# EasyEDA Pro project EasyEDApro.epro, schematic Main board
Create Date: 2024-05-27; Page Name: P1; Project Name: Robonomics SWS 2 GANG; Schematic Name: Main board; Update Date: 2024-05-27; Company: Robonomics.network; Drawed: ludovich88; Page Size: A3; Part Number: SWS-2G-E-ESP_MB; Reviewed: ludovich88; Version: V0.1
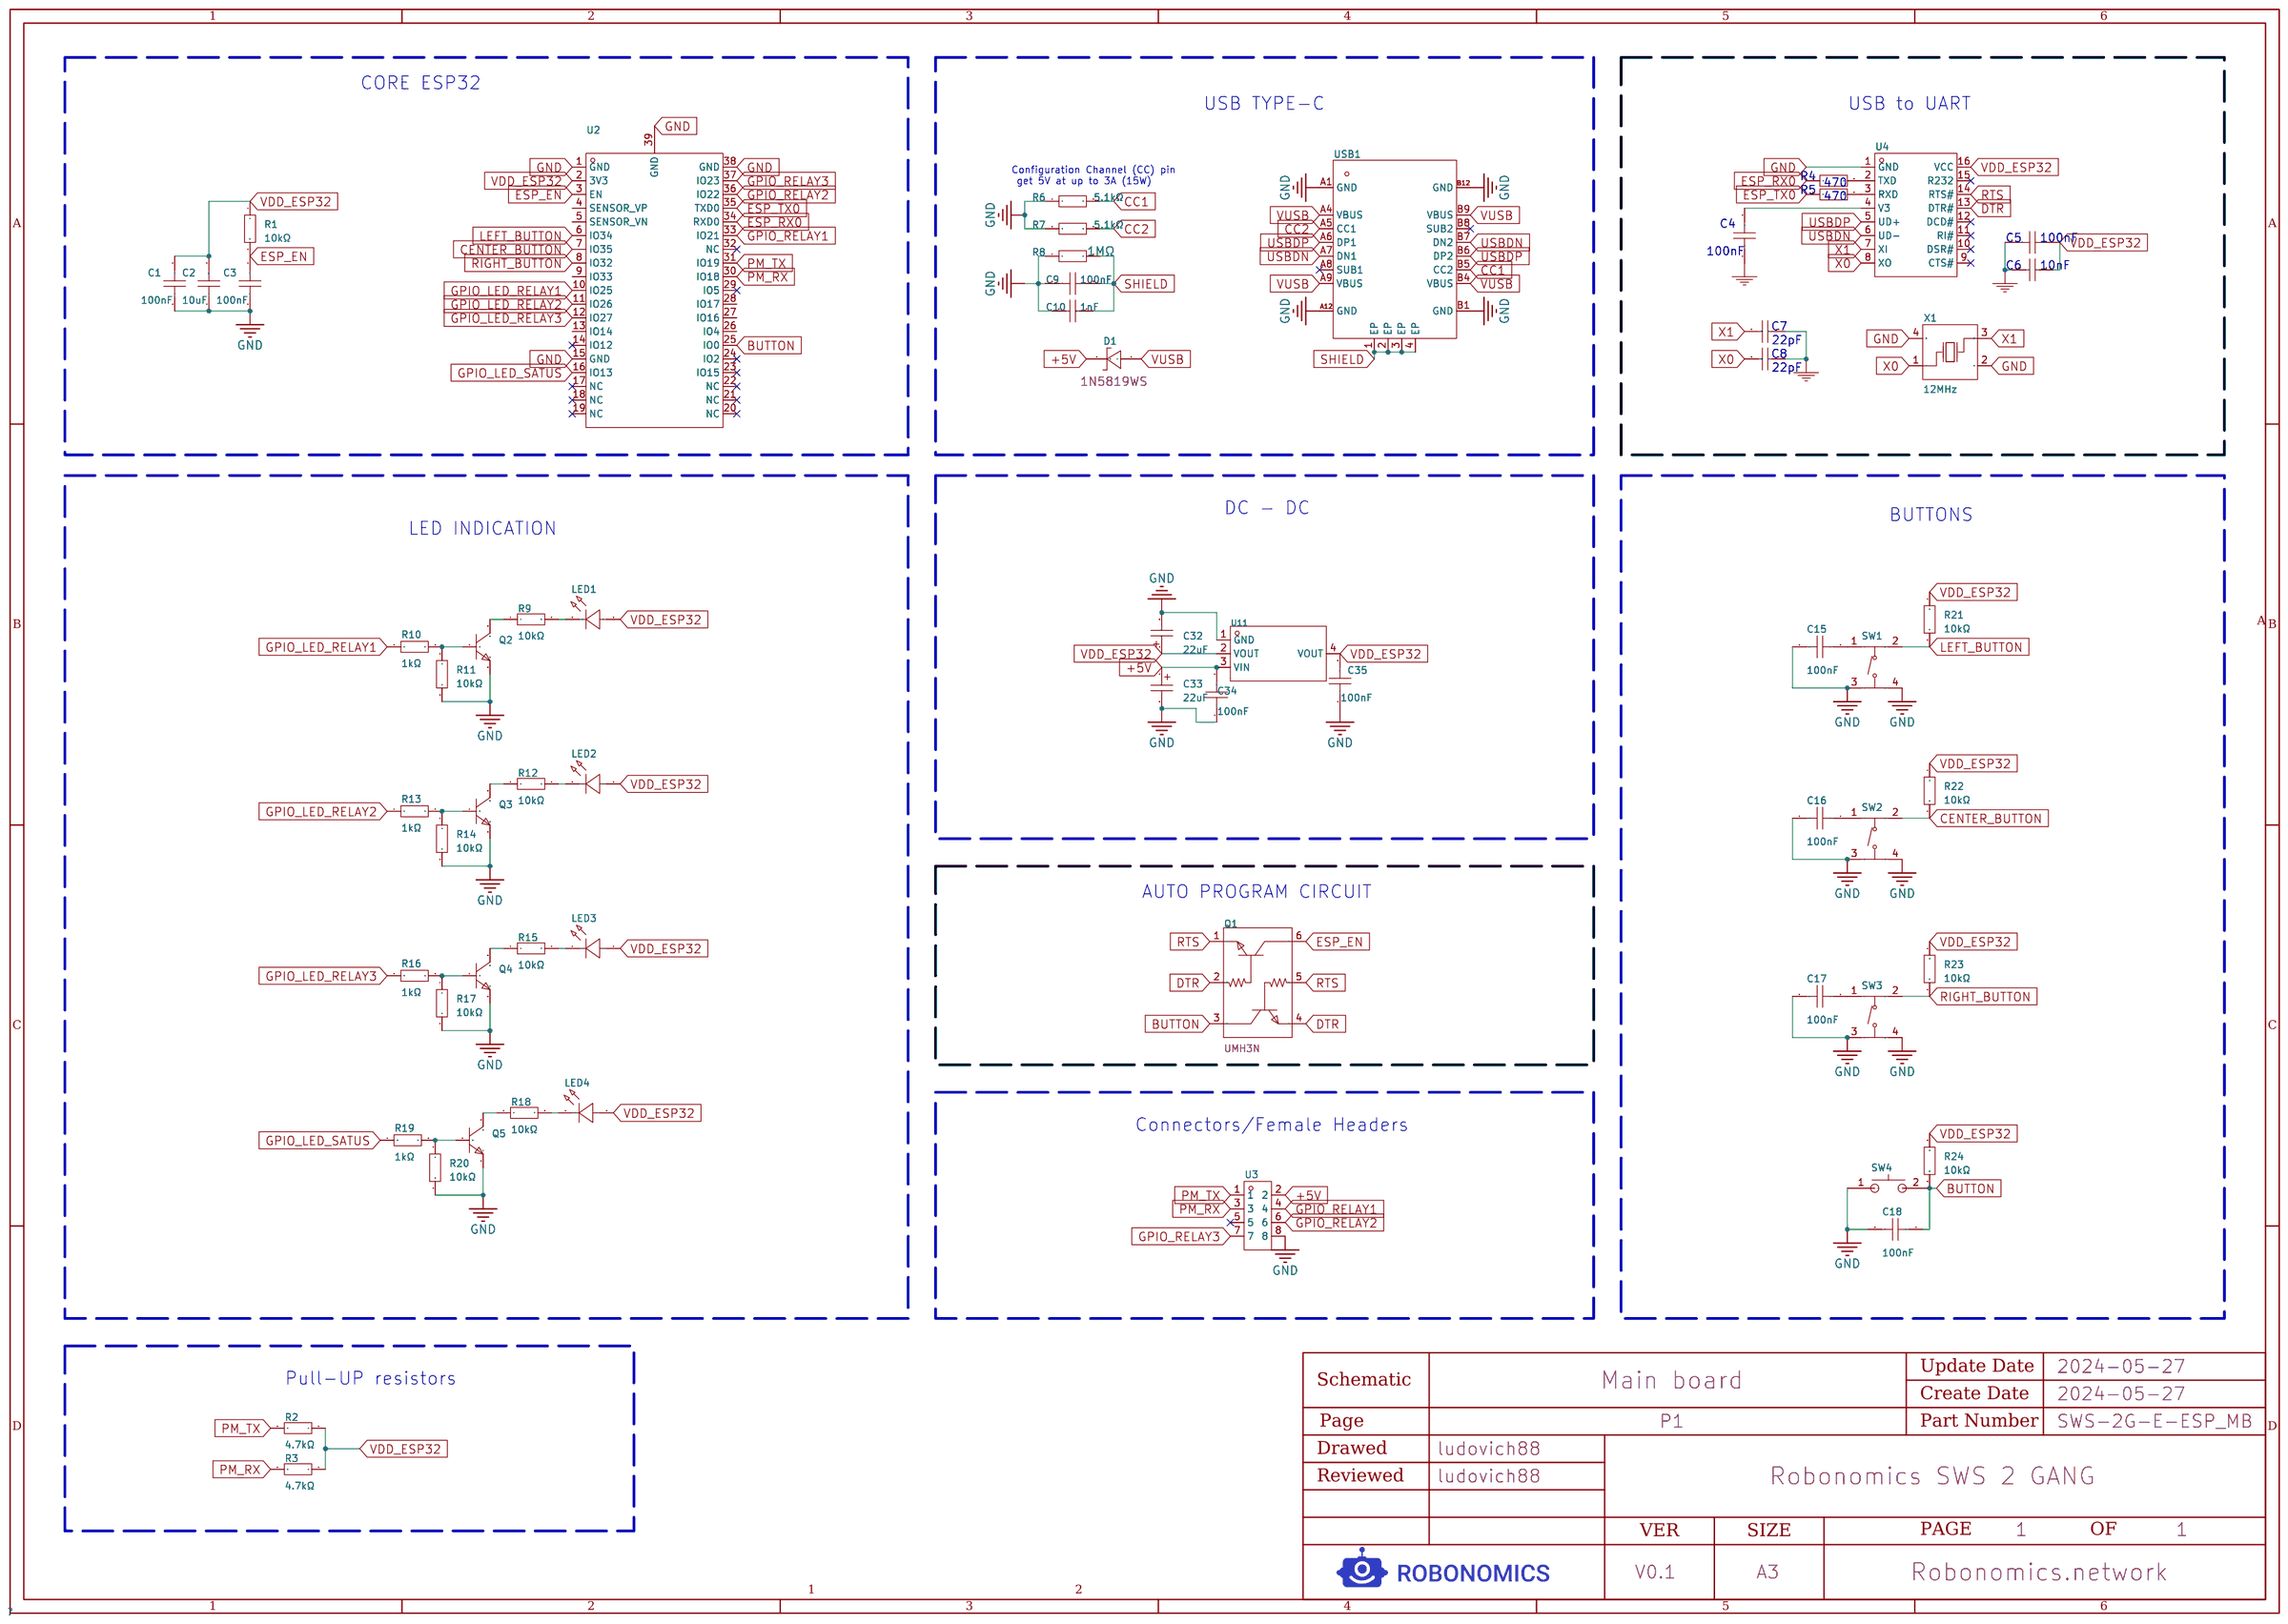
[diagram p1: schematic sheet]

## Parts
C1  100nF  [C0603]
C2  10uF  [C0603]
C3  100nF  [C0603]
C4  100nF  [C0603]
C5  100nF  [C0603]
C6  10nF  [C0603]
C7  22pF  [C0603]
C8  22pF  [C0603]
C9  100nF  [C0603]
C10  1nF  [C0603]
C15  100nF  [C0603]
C16  100nF  [C0603]
C17  100nF  [C0603]
C18  100nF  [C0603]
C32  22uF  [CASE-A_3216]
C33  22uF  [CASE-A_3216]
C34  100nF  [C0603]
C35  100nF  [C0603]
D1  -  [SOD-323_L1.8-W1.3-LS2.5-RD]
LED1  -  [LED0402-RD_BLUE]
LED2  -  [LED0402-RD_BLUE]
LED3  -  [LED0402-RD_BLUE]
LED4  -  [LED0402-RD_GREEN]
Q1  -  [SC-70-6_L2.2-W1.3-P0.65-LS2.1-BR]
Q2  -  [SOT-23-3_L2.9-W1.6-P1.90-LS2.8-BR]
Q3  -  [SOT-23-3_L2.9-W1.6-P1.90-LS2.8-BR]
Q4  -  [SOT-23-3_L2.9-W1.6-P1.90-LS2.8-BR]
Q5  -  [SOT-23-3_L2.9-W1.6-P1.90-LS2.8-BR]
R1  10kΩ  [R0603]
R2  4.7kΩ  [R0603]
R3  4.7kΩ  [R0603]
R4  470  [R0603]
R5  470  [R0603]
R6  5.1kΩ  [R0603]
R7  5.1kΩ  [R0603]
R8  1MΩ  [R0603]
R9  10kΩ  [R0603]
R10  1kΩ  [R0603]
R11  10kΩ  [R0603]
R12  10kΩ  [R0603]
R13  1kΩ  [R0603]
R14  10kΩ  [R0603]
R15  10kΩ  [R0603]
R16  1kΩ  [R0603]
R17  10kΩ  [R0603]
R18  10kΩ  [R0603]
R19  1kΩ  [R0603]
R20  10kΩ  [R0603]
R21  10kΩ  [R0603]
R22  10kΩ  [R0603]
R23  10kΩ  [R0603]
R24  10kΩ  [R0603]
SW1  TS-1187A-C-J-B  [SW-SMD_4P-L5.1-W5.1-P3.70-LS6.5-TL-2]
SW2  TS-1187A-C-J-B  [SW-SMD_4P-L5.1-W5.1-P3.70-LS6.5-TL-2]  (no BOM)
SW3  TS-1187A-C-J-B  [SW-SMD_4P-L5.1-W5.1-P3.70-LS6.5-TL-2]
SW4  -  [SW-SMD_L3.9-W2.9-P4.15-LS5.0]
U2  -  [WIFI-SMD_ESP32-WROOM-32E]
U3  -  [CONN-TH_8P-P2.00_DEALON_DW200R-22-08-45]
U4  -  [SOIC-16_L9.9-W3.9-P1.27-LS6.0-BL]
U11  AMS1117-3.3  [SOT-223-3_L6.5-W3.4-P2.30-LS7.0-BR]
USB1  -  [USB-C-SMD_KH-TYPE-C-16P]
X1  12MHz  [OSC-SMD_4P-L3.2-W2.5-BL]

## Library data of the parts
C1 C3 = CC0603KRX7R9BB104: Capacitance: Tolerance:±10% Tolerance:±10% Voltage Rated: Temperature Coefficient:; LCSC Part Name: 100nF ±10% 50V; Supplier Part: C14663; Manufacturer: YAGEO(国巨); Supplier Footprint: 0603; JLCPCB Part Class: Basic Part; Datasheet: https://atta.szlcsc.com/upload/public/pdf/source/20180910/C282072_33301C7F631E79921B82A8DAC6BCC5B3.pdf; Supplier: LCSC; Tolerance: ±10%; Voltage Rated: 50V; Temperature Coefficient: Y5V
C2 = CL10A106KP8NNNC: Capacitance: Tolerance:±10% Tolerance:±10% Voltage Rated: Temperature Coefficient:; LCSC Part Name: 10uF ±10% 10V; Supplier Part: C19702; Manufacturer: SAMSUNG(三星); Supplier Footprint: 0603; JLCPCB Part Class: Basic Part; Datasheet: https://atta.szlcsc.com/upload/public/pdf/source/20160218/1457707763339.pdf; Supplier: LCSC; Tolerance: ±10%; Voltage Rated: 10V; Temperature Coefficient: X5R
C4 C5 C15-C18 C34 C35 = CC0603KRX7R9BB104: Capacitance: Tolerance:±10% Tolerance:±10% Voltage Rated: Temperature Coefficient:; LCSC Part Name: 100nF ±10% 50V; Supplier Part: C14663; Manufacturer: YAGEO(国巨); Supplier Footprint: 0603; JLCPCB Part Class: Basic Part; Datasheet: https://atta.szlcsc.com/upload/public/pdf/source/20180910/C282072_33301C7F631E79921B82A8DAC6BCC5B3.pdf; Supplier: LCSC; Tolerance: ±10%
C6 = 0603B103K500NT: Supplier: LCSC; Manufacturer: FH; Supplier Part: C57112; JLCPCB Part Class: BasicPart
C7 C8 = CL10C220JB8NNNC: Supplier: LCSC; Manufacturer: SAMSUNG; Supplier Part: C1653; JLCPCB Part Class: BasicPart
C9 = CC0603KRX7R9BB104: Capacitance: Tolerance:±10% Tolerance:±10% Voltage Rated: Temperature Coefficient:; LCSC Part Name: 100nF ±10% 50V; Supplier Part: C14663; Manufacturer: YAGEO(国巨); Supplier Footprint: 0603; JLCPCB Part Class: Basic Part; Datasheet: https://atta.szlcsc.com/upload/public/pdf/source/20180910/C282072_33301C7F631E79921B82A8DAC6BCC5B3.pdf; Supplier: LCSC; Tolerance: ±10%; Voltage Rated: 50V; Temperature Coefficient: X7R
C10 = CL10B102KB8NNNC: Capacitance:1nFTolerance:±10%Tolerance:±10%VoltageRated:50VTemperatureCoefficient:X7R; LCSC Part Name: 1nF±10%50V; Supplier Part: C1588; Manufacturer: SAMSUNG(三星); Supplier Footprint: 0603; JLCPCB Part Class: BasicPart; Datasheet: https://atta.szlcsc.com/upload/public/pdf/source/20160103/1457707679526.pdf; Supplier: LCSC; Tolerance: ±10%; Voltage Rated: 50V; Temperature Coefficient: X7R
C32 C33 = TAJA226K010RNJ: Capacitance: Tolerance:±10% Tolerance:±10% Rated Voltage: Equivalent Series Resistance(ESR):3Ω@100kHz Operating Temperature:-55℃~+125℃ Operating Temperature:-55℃~+125℃; LCSC Part Name: 22uF ±10% 10V; Supplier Part: C11366; Manufacturer: Kyocera AVX; JLCPCB Part Class: Extended Part; Datasheet: https://atta.szlcsc.com/upload/public/pdf/source/20160107/1457707744993.pdf; Supplier: LCSC; Tolerance: ±10%; Equivalent Series Resistance(ESR): 3Ω@100kHz; Operating Temperature: -55℃~+125℃
D1 = 1N5819WS: ReverseVoltage(Vr):40VAverageRectifiedCurrent(Io):1AForwardVoltage(Vf@If):600mV@1A; LCSC Part Name: 40V1A600mV@1A; Supplier Part: C191023; Manufacturer: Hottech(合科泰); Supplier Footprint: SOD-323; JLCPCB Part Class: BasicPart; Datasheet: https://atta.szlcsc.com/upload/public/pdf/source/20180614/C191023_3C6A6398B911F3A4C23E7538EE054643.pdf; Supplier: LCSC; Reverse Voltage (Vr): 40V; Average Rectified Current (Io): 1A; Forward Voltage (Vf@If): 600mV@1A
LED1-LED3 = SZYY0402B: EmittedColor:blueDominantWavelength:466nm~469nmDominantWavelength:466nm~469nmPeakWavelength:-ColorTemperature:-ColorTemperature:-LuminousFlux(@25℃):-ForwardCurrent:5mAForwardVoltage(VF):3.2VLuminousIntensity:85mcdPowerDissipation:-; LCSC Part Name: 蓝灯; Supplier Part: C434447; Manufacturer: yongyu(永裕光电); Supplier Footprint: 0402; Datasheet: https://atta.szlcsc.com/upload/public/pdf/source/20210222/C434447_30232BB6183B52026028ECA50B9DAB35.pdf; Supplier: LCSC; Emitted Color: blue; Dominant Wavelength: 466nm~469nm; Forward Current: 5mA; Forward Voltage (VF): 3.2V; Luminous Intensity: 85mcd; Viewing Angle: 120°; Operating Temperature: -40℃~+85℃
LED4 = SZYY0402G: EmittedColor:Emerald; LCSC Part Name: 翠绿; Supplier Part: C434446; Manufacturer: yongyu(永裕光电); Supplier Footprint: 0402; JLCPCB Part Class: ExtendedPart; Datasheet: https://atta.szlcsc.com/upload/public/pdf/source/20210222/C434446_DCC8DCB40C4FD7B302B323BBEA2FF3EC.pdf; Supplier: LCSC; Emitted Color: Emerald
Q1 = UMH3N: TransistorType:2个NPN-预偏置PowerDissipation(Pd):150mWCollectorCurrent(Ic):100mACollector-EmitterBreakdownVoltage(Vceo):50V; LCSC Part Name: 2个NPN-预偏置100mA50V; Supplier Part: C62892; Manufacturer: CJ(江苏长电/长晶); Supplier Footprint: SC-70-6(SOT-363); JLCPCB Part Class: ExtendedPart; Datasheet: https://atta.szlcsc.com/upload/public/pdf/source/20151109/1457707575095.pdf; Supplier: LCSC; Transistor Type: 2个NPN-预偏置; Power Dissipation (Pd): 150mW; Collector Current (Ic): 100mA; Collector-Emitter Breakdown Voltage (Vceo): 50V
Q2-Q5 = SS8050_C181160: TransistorType:Collector-EmitterBreakdownVoltage(Vceo):CollectorCurrent(Ic):PowerDissipation(Pd):CollectorCut-OffCurrent(Icbo):100nACollector-EmitterSaturationVoltage(VCE(sat)@Ic,Ib):500mV@800mA,80mADCCurrentGain(hFE@Ic,Vce):200@100; LCSC Part Name: NPN25V1.5AH档（200-350）; Supplier Part: C181160; Manufacturer: Hottech(合科泰); Manufacturer Part: SS8050; Supplier Footprint: SOT-23; JLCPCB Part Class: ExtendedPart; Datasheet: https://atta.szlcsc.com/upload/public/pdf/source/20220506/87BBA77FEE9CB4B19031AE933C67329E.pdf; Supplier: LCSC; Collector Cut-Off Current (Icbo): 100nA; Collector-Emitter Saturation Voltage (VCE(sat)@Ic,Ib): 500mV@800mA,80mA; DC Current Gain (hFE@Ic,Vce): 200@100mA,1V; Transition Frequency (fT): 100MHz; Operating Temperature: +150℃@(Tj)
R1 R9 R11 R12 R14 R15 R17 R18 R20-R24 = 0603WAF1002T5E: Resistance:10000Ω Tolerance:±1% Tolerance:±1% Power(Watts): Overload Voltage (Max): Temperature Coefficient:±100ppm/℃ Temperature Coefficient:±100ppm/℃ Type:Thick Film Resistors Operating Temperature Range:-55℃~+155℃ Operating Temperature Range:-55℃~+155℃; LCSC Part Name: 10kΩ ±1% 100mW 厚膜电阻; Supplier Part: C25804; Manufacturer: UNI-ROYAL(厚声); Supplier Footprint: 0603; JLCPCB Part Class: Basic Part; Datasheet: https://atta.szlcsc.com/upload/public/pdf/source/20200306/C422600_1E6D84923E4A46A82E41ADD87F860B5C.pdf; Supplier: LCSC; Tolerance: ±1%; Power(Watts): 1/10W; Overload Voltage (Max): 75V; Temperature Coefficient: ±100ppm/℃; Type: Thick Film Resistors; Operating Temperature Range: -55℃~+155℃
R2 R3 = RMC06034K7JN: Resistance:Tolerance:±5%Tolerance:±5%Power(Watts):; LCSC Part Name: 4.7kΩ±5%100mW; Supplier Part: C269694; Manufacturer: Tyohm(幸亚电阻); Supplier Footprint: 0603; JLCPCB Part Class: ExtendedPart; Datasheet: https://atta.szlcsc.com/upload/public/pdf/source/20190115/C269694_8DB59FA47BFB5717A32940FE118C845B.pdf; Supplier: LCSC; Tolerance: ±5%
R4 R5 = 0603WAF4700T5E: Supplier: LCSC; Manufacturer: UniOhm; Supplier Part: C23179; JLCPCB Part Class: BasicPart
R6 R7 = 0603WAF5101T5E: Type:厚膜电阻 Resistance:5.1kΩ Tolerance:±1% Power(Watts):1/10W Temperature Coefficient:±100ppm/ Temperature Coefficient:±100ppm/ Overload Voltage (Max):75V Operating Temperature Range:-55~+155 Operating Temperature Range:-55~+155; LCSC Part Name: 5.1kΩ±1%; Supplier Part: C23186; Manufacturer: UNI-ROYAL(厚声); Supplier Footprint: 0603; JLCPCB Part Class: BasicPart; Datasheet: https://atta.szlcsc.com/upload/public/pdf/source/20200306/C422600_1E6D84923E4A46A82E41ADD87F860B5C.pdf; Supplier: LCSC; Type: 厚膜电阻; Tolerance: ±1%; Power(Watts): 1/10W; Temperature Coefficient: ±100ppm/; Overload Voltage (Max): 75V; Operating Temperature Range: -55~+155
R8 = 0603WAF1004T5E: LCSC Part Name: 1MΩ(1004)±1%编带; Supplier Part: C22935; Manufacturer: UNI-ROYAL(厚声); Supplier Footprint: 0603; JLCPCB Part Class: BasicPart; Datasheet: https://atta.szlcsc.com/upload/public/pdf/source/20170920/C22935_1505900992858982324.pdf; Supplier: LCSC
R10 R13 R16 R19 = RC0603FR-071KL: Resistance:Tolerance:±1%Tolerance:±1%Power(Watts):TemperatureCoefficient:±100ppm/℃TemperatureCoefficient:±100ppm/℃OverloadVoltage(Max):OperatingTemperatureRange:-55℃~+155℃OperatingTemperatureRange:-55℃~+155℃; LCSC Part Name: 1kΩ±1%100mW; Supplier Part: C22548; Manufacturer: YAGEO(国巨); Supplier Footprint: 0603; JLCPCB Part Class: ExtendedPart; Datasheet: https://atta.szlcsc.com/upload/public/pdf/source/20180312/7BD3618A8B6324EA6280B0497A051AB7.pdf; Supplier: LCSC; Tolerance: ±1%; Temperature Coefficient: ±100ppm/℃; Operating Temperature Range: -55℃~+155℃
SW1-SW3 = TS-1187A-C-J-B: Contact Current:50mA Voltage Rating (DC):12V Insulation Resistance:- Circuit:SPST Mounting Style:Brick nogging Actuator Style:Round Button Actuator/Cap Color:金色 With Lamp:No Operating Force:260gf Mechanical Life:100000次 Operating Temperature:-30℃~+85℃ Ope; LCSC Part Name: 5.1*5.1*5mm 立贴 轻触开关; Supplier Part: C318885; Manufacturer: XKB Connectivity(中国星坤); Supplier Footprint: SMD; JLCPCB Part Class: Extended Part; Datasheet: https://atta.szlcsc.com/upload/public/pdf/source/20200227/C318885_9DC3A547B5B2026C7949C4FE22CAF34B.pdf; Supplier: LCSC; Contact Current: 50mA; Voltage Rating (DC): 12V; Circuit: SPST; Mounting Style: Brick nogging; Actuator Style: Round Button; Actuator/Cap Color: 金色; With Lamp: No; Operating Force: 260gf; Mechanical Life: 100000次; Operating Temperature: -30℃~+85℃; Switch Length: 5.1mm; Switch Width: 5.1mm; Switch Height: 5mm; Strike Gundam: NO
SW4 = GT-TC029B-H020-L1N: ContactCurrent:50mAVoltageRating(DC):12VInsulationResistance:100MΩCircuit:SPSTMountingStyle:BricknoggingActuatorStyle:RoundButtonActuator/CapColor:BlackWithLamp:NoOperatingForce:250gf@±30gfMechanicalLife:100000OperatingTemperature:-; LCSC Part Name: 立式两脚小龟H2.0250gf无柱; Supplier Part: C843665; Manufacturer: G-Switch(品赞); Supplier Footprint: SMD; Datasheet: https://atta.szlcsc.com/upload/public/pdf/source/20201014/C843665_B07D254A2E90B746498E934B945CCD5F.pdf; Supplier: LCSC; Contact Current: 50mA; Voltage Rating (DC): 12V; Insulation Resistance: 100MΩ; Circuit: SPST; Mounting Style: Bricknogging; Actuator Style: RoundButton; Actuator/Cap Color: Black; With Lamp: No; Operating Force: 250gf@±30gf; Mechanical Life: 100000; Operating Temperature: -30℃~+85℃; Pin Style: SMDSplicing; Switch Length: 3.9mm; Switch Width: 2.9mm; Switch Height: 2mm; Strike Gundam: NO
U2 = ESP32-WROOM-32E-N4_C701341: LCSC Part Name: 通用型Wi-Fi+BT+BLE的MCU模组PCB板载天线模组; Supplier Part: C701341; Manufacturer: ESPRESSIF(乐鑫); Manufacturer Part: ESP32-WROOM-32E-N4; Supplier Footprint: SMD,18x25.5mm; JLCPCB Part Class: ExtendedPart; Datasheet: https://atta.szlcsc.com/upload/public/pdf/source/20220601/0020821B65DE5740BBACA5FACC5CF3B6.pdf; Supplier: LCSC
U3 = DW200R-22-08-45: NumberofRows:双排NumberofHoles:8Pitch:2mmHolesStructure:2x4PRowSpacing:2mmMountingType:StraightCircularHole/SquareHole:SquareHolesCurrentRating(Max):1.5AVoltageRating(Max):-HolesDirection:TopInsulationHeight:4mmOperatingTempera; LCSC Part Name: 2mm2x4P; Supplier Part: C2935889; Manufacturer: DEALON(德艺隆); Supplier Footprint: 直插,P=2mm; Datasheet: https://atta.szlcsc.com/upload/public/pdf/source/20211231/4AAE734E989B72774920282673BDAE8F.pdf; Supplier: LCSC; Number of Rows: 双排; Number of Holes: 8; Pitch: 2mm; Holes Structure: 2x4P; Row Spacing: 2mm; Mounting Type: Straight; Circular Hole / Square Hole: SquareHoles; Current Rating (Max): 1.5A; Holes Direction: Top; Insulation Height: 4mm
U4 = CH340G: Type:TransceiverProtocol:USB2.0NumberofDrivers/Receivers:-DataRate:2MbpsSupplyVoltage:3.3V,5V; Supplier Part: C14267; Manufacturer: WCH(南京沁恒); Supplier Footprint: SOP-16_150mil; JLCPCB Part Class: ExtendedPart; Datasheet: https://atta.szlcsc.com/upload/public/pdf/source/20200819/C14267_9F0B4B8160AEBA86F3219E64956E4601.pdf; Supplier: LCSC; Type: Transceiver; Protocol: USB2.0; Data Rate: 2Mbps; Supply Voltage: 3.3V,5V
U11 = AMS1117-3.3_C6186: Output Type: Maximum Input Voltage:- Output Voltage:3.3V Output Voltage:3.3V MAX Output Current:1A Power Supply Rejection Ratio (PSRR):72dB@(120Hz) Dropout Voltage:1.3V@(800mA) standby current:- Noise:- Feature:- Operating Temperature:- Operating Temperat; LCSC Part Name: 输出3.3V 1A; Supplier Part: C6186; Manufacturer: AMS; Supplier Footprint: SOT-223-3; JLCPCB Part Class: Basic Part; Datasheet: https://atta.szlcsc.com/upload/public/pdf/source/20180727/C6186_7A095716F0823C02F1997A905E26C086.pdf; Supplier: LCSC; Output Voltage: 3.3V; MAX Output Current: 1A; Power Supply Rejection Ratio (PSRR): 72dB@(120Hz); Dropout Voltage: 1.3V@(800mA); Output Polarity: Positive electrode; Number of Outputs: 1
USB1 = KH-TYPE-C-16P: ConnectorType:Type-CStandard:-Gender:FemaleNumberofContacts:16NumberofPorts:1MountingStyle:SurfaceMountCurrentRating-Power(Max):3AOperatingTemperatureRange:-40℃~+85℃OperatingTemperatureRange:-40℃~+85℃; LCSC Part Name: Type-C母座卧贴; Supplier Part: C709357; Manufacturer: kinghelm(金航标); Supplier Footprint: SMD; Datasheet: https://atta.szlcsc.com/upload/public/pdf/source/20200911/C709357_AA8DCEB38BB20E3035A7ED7AE7667837.pdf; Supplier: LCSC; Connector Type: Type-C; Gender: Female; Number of Contacts: 16; Number of Ports: 1; Mounting Style: SurfaceMount; Current Rating - Power (Max): 3A; Operating Temperature Range: -40℃~+85℃
X1 = X322512MSB4SI: Crystal Type:贴片无源晶振 Frequency:12MHz Frequency Tolerance:±10ppm Frequency Tolerance:±10ppm Frequency Stability:±30ppm Frequency Stability:±30ppm Load Capacitance:20pF Operating Temperature:-40~+85 Operating Temperature:-40~+85; LCSC Part Name: 12MHz±10ppm20pF; Supplier Part: C9002; Manufacturer: YXC扬兴科技; Supplier Footprint: SMD3225-4P; JLCPCB Part Class: BasicPart; Datasheet: https://atta.szlcsc.com/upload/public/pdf/source/20210329/C112971_1F611BDC486E193C1706F6D8EB5AA189.pdf; Supplier: LCSC; Crystal Type: 贴片无源晶振; Frequency Tolerance: ±10ppm; Frequency Stability: ±30ppm; Load Capacitance: 20pF; Operating Temperature: -40~+85

## Nets
+5V: C33.1 C34.2 D1.1(C) U3.2 U11.3(VIN)
GND: C1.2 C2.1 C3.2 C4.1 C5.2 C6.2 C7.1 C8.1 C9.1 C10.1 C15.2 C16.2 C17.2 C18.2 C32.2 C33.2 C34.1 C35.1 Q2.2(E) Q3.2(E) Q4.2(E) Q5.2(E) R6.1 R7.1 R8.1 R11.2 R14.2 R17.2 R20.2 SW1.3(C) SW1.4(D) SW2.3(C) SW2.4(D) SW3.3(C) SW3.4(D) SW4.1 U2.1(GND) U2.15(GND) U2.38(GND) U2.39(GND) U3.8 U4.1(GND) U11.1(GND) USB1.A1(GND) USB1.A12(GND) USB1.B1(GND) USB1.B12(GND) X1.2(GND) X1.4(GND)
VDD_ESP32: C1.1 C2.2 C5.1 C6.1 C32.1 C35.2 LED1.2(A) LED2.2(A) LED3.2(A) LED4.2(A) R1.1 R2.1 R3.1 R21.1 R22.1 R23.1 R24.1 U2.2(3V3) U4.16(VCC) U11.2(VOUT) U11.4(VOUT)
BUTTON: C18.1 Q1.3(C) R24.2 SW4.2 U2.25(IO0)
CC1: R6.2 USB1.B5(CC2)
CC2: R7.2 USB1.A5(CC1)
CENTER_BUTTON: R22.2 SW2.2(B) U2.7(IO35)
DTR: Q1.2(B) Q1.4(E) U4.13(DTR#)
ESP_EN: C3.1 Q1.6(C) R1.2 U2.3(EN)
ESP_RX0: R4.1 U2.34(RXD0)
ESP_TX0: R5.1 U2.35(TXD0)
GPIO_LED_RELAY1: R10.1 U2.10(IO25)
GPIO_LED_RELAY2: R13.1 U2.11(IO26)
GPIO_LED_RELAY3: R16.1 U2.12(IO27)
GPIO_LED_SATUS: R19.1 U2.16(IO13)
GPIO_RELAY1: U2.33(IO21) U3.4
GPIO_RELAY2: U2.36(IO22) U3.6
GPIO_RELAY3: U2.37(IO23) U3.7
LEFT_BUTTON: R21.2 SW1.2(B) U2.6(IO34)
PM_RX: R3.2 U2.30(IO18) U3.3
PM_TX: R2.2 U2.31(IO19) U3.1
RIGHT_BUTTON: R23.2 SW3.2(B) U2.8(IO32)
RTS: Q1.1(E) Q1.5(B) U4.14(RTS#)
SHIELD: C9.2 C10.2 R8.2 USB1.1(EP) USB1.2(EP) USB1.3(EP) USB1.4(EP)
USBDN: U4.6(UD-) USB1.A7(DN1) USB1.B7(DN2)
USBDP: U4.5(UD+) USB1.A6(DP1) USB1.B6(DP2)
VUSB: D1.2(A) USB1.A4(VBUS) USB1.A9(VBUS) USB1.B4(VBUS) USB1.B9(VBUS)
X0: C8.2 U4.8(XO) X1.1(OSC1)
X1: C7.2 U4.7(XI) X1.3(OSC2)
$1N1912: LED1.1(K) R9.2
$1N1913: Q2.3(C) R9.1
$1N1918: Q2.1(B) R10.2 R11.1
$1N1919: LED4.1(K) R18.2
$1N1920: Q5.3(C) R18.1
$1N1924: Q5.1(B) R19.2 R20.1
$1N10887: LED2.1(K) R12.2
$1N10888: Q3.3(C) R12.1
$1N10892: Q3.1(B) R13.2 R14.1
$1N11267: LED3.1(K) R15.2
$1N11268: Q4.3(C) R15.1
$1N11272: Q4.1(B) R16.2 R17.1
$1N27173: C4.2 U4.4(V3)
$1N27175: R5.2 U4.3(RXD)
$1N27176: R4.2 U4.2(TXD)
$1N42639: C15.1 SW1.1(A)
$1N42662: C17.1 SW3.1(A)
$1N42685: C16.1 SW2.1(A)

Not connected (* = marked no-connect by the designer): U2 4(SENSOR_VP) 5(SENSOR_VN) 9(IO33) 13(IO14) 14(IO12)* 17(NC)* 18(NC)* 19(NC)* 20(NC)* 21(NC)* 22(NC)* 23(IO15)* 24(IO2)* 26(IO4) 27(IO16) 28(IO17) 29(IO5)* 32(NC)*; U3 5*; U4 9(CTS#)* 10(DSR#)* 11(RI#)* 12(DCD#)* 15(R232)*; USB1 A8(SUB1)* B8(SUB2)*

## Notes on the sheet
- CORE ESP32
- USB TYPE-C
- USB to UART
- Configuration Channel (CC) pin
   get 5V at up to 3A (15W)
- DC - DC
- BUTTONS
- LED INDICATION
- AUTO PROGRAM CIRCUIT
- Connectors/Female Headers
- Pull-UP resistors
